# EAGLE design Template_V1.0_vias (EAGLE 7.2.0)
CNAME: EARS PocketQube Template; CREVISION: 1.0; DESIGNER: M. Isbell & L. Stant
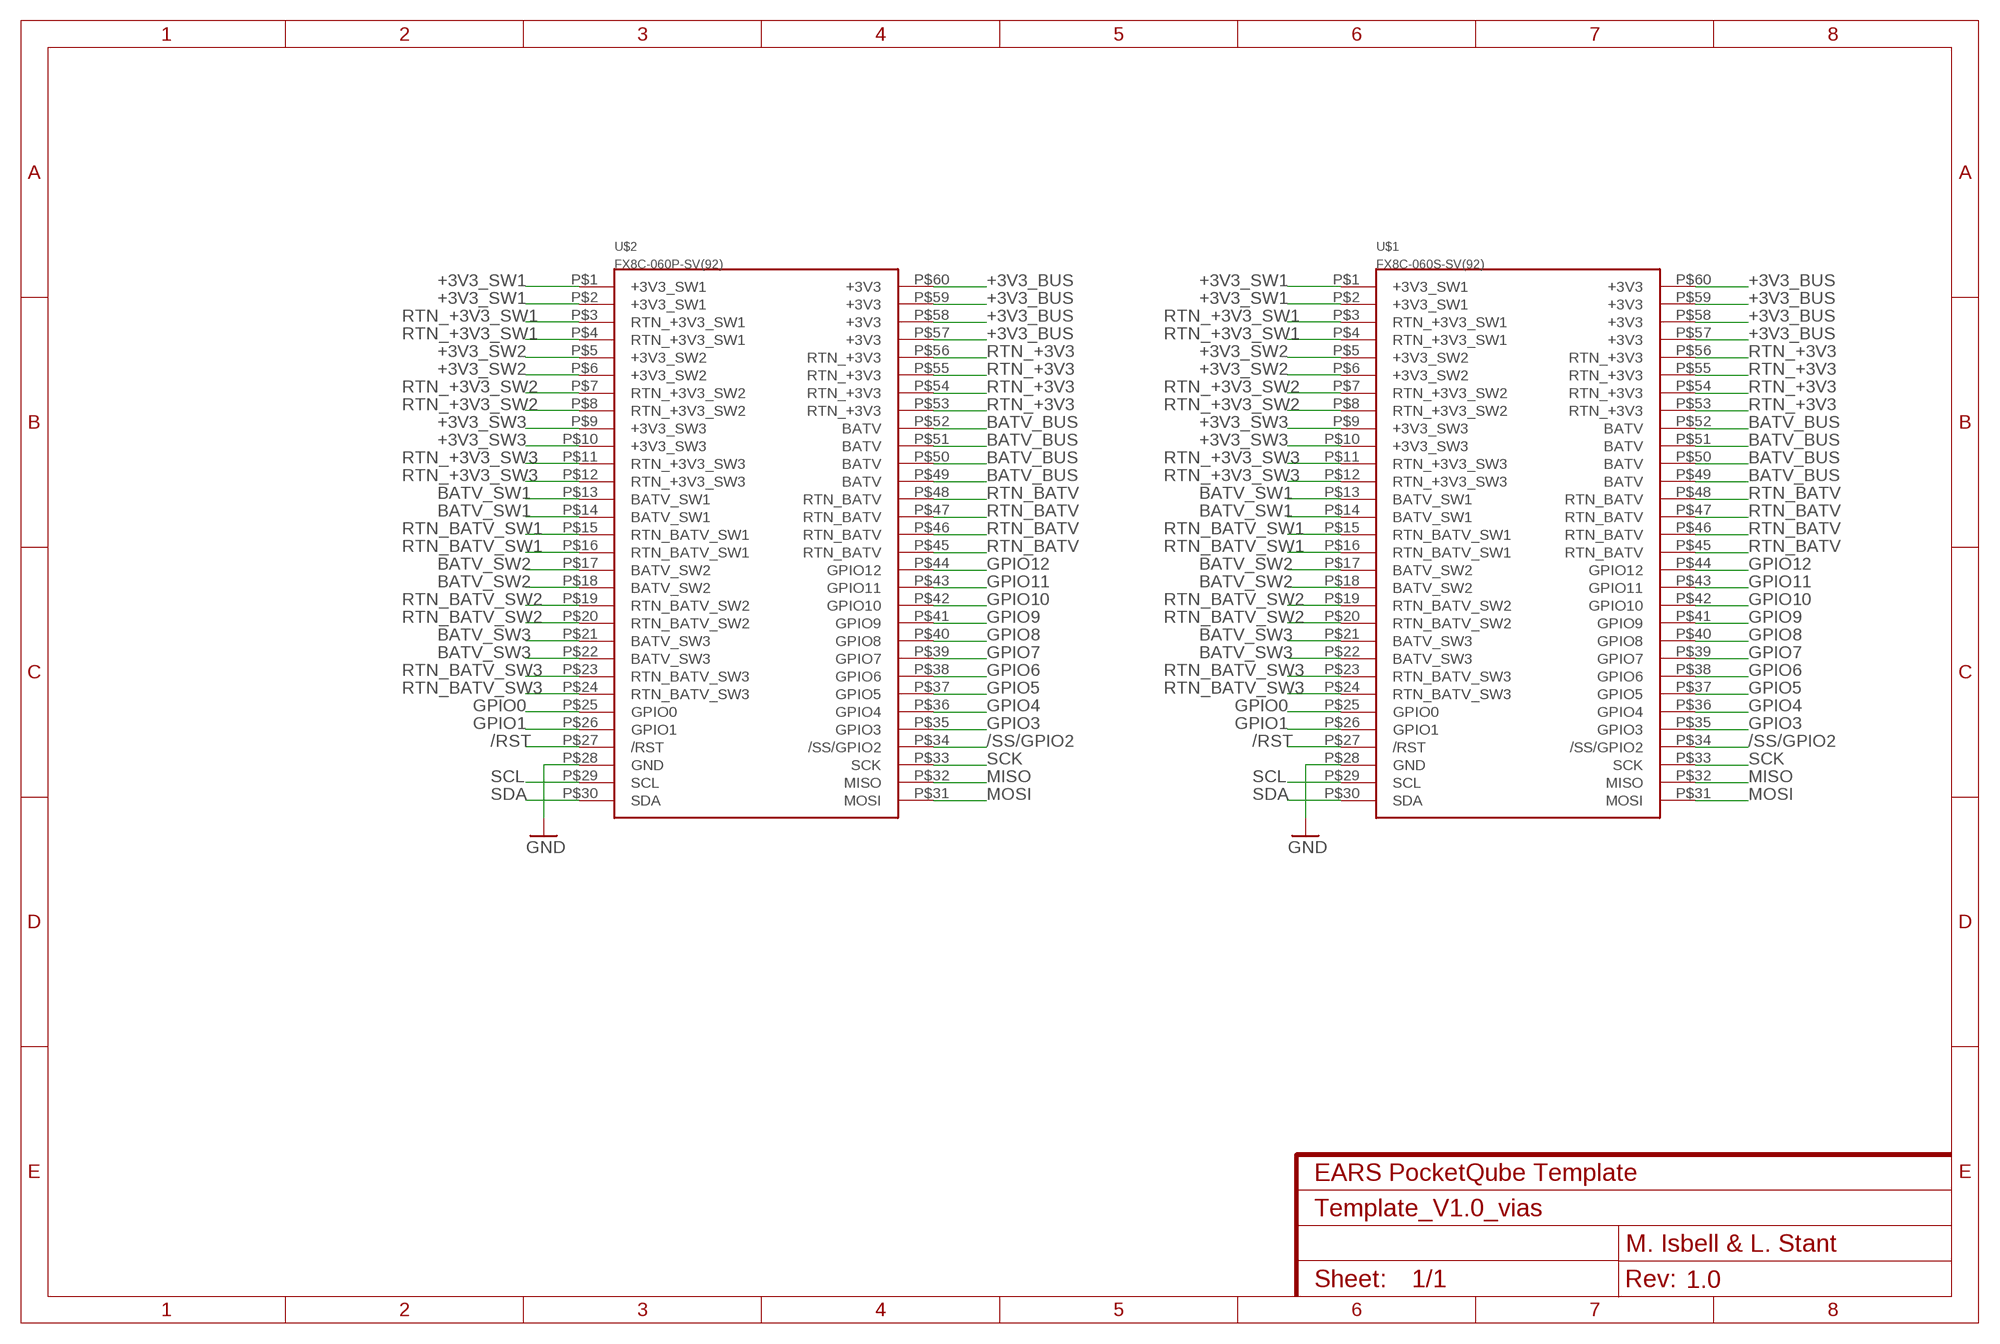
[diagram p0: schematic, sheet 1]

## Parts
U$1  FX8C-060S-SV(92)  [FX8C-060S-SV(92)]
U$2  FX8C-060P-SV(92)  [FX8C-060P-SV(92)]

## Nets
+3V3_BUS: U$1.P$57(+3V3) U$1.P$58(+3V3) U$1.P$59(+3V3) U$1.P$60(+3V3) U$2.P$57(+3V3) U$2.P$58(+3V3) U$2.P$59(+3V3) U$2.P$60(+3V3)
+3V3_SW1: U$1.P$1(+3V3_SW1) U$1.P$2(+3V3_SW1) U$2.P$1(+3V3_SW1) U$2.P$2(+3V3_SW1)
+3V3_SW2: U$1.P$5(+3V3_SW2) U$1.P$6(+3V3_SW2) U$2.P$5(+3V3_SW2) U$2.P$6(+3V3_SW2)
+3V3_SW3: U$1.P$9(+3V3_SW3) U$1.P$10(+3V3_SW3) U$2.P$9(+3V3_SW3) U$2.P$10(+3V3_SW3)
/RST: U$1.P$27(/RST) U$2.P$27(/RST)
/SS/GPIO2: U$1.P$34(/SS/GPIO2) U$2.P$34(/SS/GPIO2)
BATV_BUS: U$1.P$49(BATV) U$1.P$50(BATV) U$1.P$51(BATV) U$1.P$52(BATV) U$2.P$49(BATV) U$2.P$50(BATV) U$2.P$51(BATV) U$2.P$52(BATV)
BATV_SW1: U$1.P$13(BATV_SW1) U$1.P$14(BATV_SW1) U$2.P$13(BATV_SW1) U$2.P$14(BATV_SW1)
BATV_SW2: U$1.P$17(BATV_SW2) U$1.P$18(BATV_SW2) U$2.P$17(BATV_SW2) U$2.P$18(BATV_SW2)
BATV_SW3: U$1.P$21(BATV_SW3) U$1.P$22(BATV_SW3) U$2.P$21(BATV_SW3) U$2.P$22(BATV_SW3)
GND: U$1.P$28(GND) U$2.P$28(GND)
GPIO0: U$1.P$25(GPIO0) U$2.P$25(GPIO0)
GPIO1: U$1.P$26(GPIO1) U$2.P$26(GPIO1)
GPIO3: U$1.P$35(GPIO3) U$2.P$35(GPIO3)
GPIO4: U$1.P$36(GPIO4) U$2.P$36(GPIO4)
GPIO5: U$1.P$37(GPIO5) U$2.P$37(GPIO5)
GPIO6: U$1.P$38(GPIO6) U$2.P$38(GPIO6)
GPIO7: U$1.P$39(GPIO7) U$2.P$39(GPIO7)
GPIO8: U$1.P$40(GPIO8) U$2.P$40(GPIO8)
GPIO9: U$1.P$41(GPIO9) U$2.P$41(GPIO9)
GPIO10: U$1.P$42(GPIO10) U$2.P$42(GPIO10)
GPIO11: U$1.P$43(GPIO11) U$2.P$43(GPIO11)
GPIO12: U$1.P$44(GPIO12) U$2.P$44(GPIO12)
MISO: U$1.P$32(MISO) U$2.P$32(MISO)
MOSI: U$1.P$31(MOSI) U$2.P$31(MOSI)
RTN_+3V3: U$1.P$53(RTN_+3V3) U$1.P$54(RTN_+3V3) U$1.P$55(RTN_+3V3) U$1.P$56(RTN_+3V3) U$2.P$53(RTN_+3V3) U$2.P$54(RTN_+3V3) U$2.P$55(RTN_+3V3) U$2.P$56(RTN_+3V3)
RTN_+3V3_SW1: U$1.P$3(RTN_+3V3_SW1) U$1.P$4(RTN_+3V3_SW1) U$2.P$3(RTN_+3V3_SW1) U$2.P$4(RTN_+3V3_SW1)
RTN_+3V3_SW2: U$1.P$7(RTN_+3V3_SW2) U$1.P$8(RTN_+3V3_SW2) U$2.P$7(RTN_+3V3_SW2) U$2.P$8(RTN_+3V3_SW2)
RTN_+3V3_SW3: U$1.P$11(RTN_+3V3_SW3) U$1.P$12(RTN_+3V3_SW3) U$2.P$11(RTN_+3V3_SW3) U$2.P$12(RTN_+3V3_SW3)
RTN_BATV: U$1.P$45(RTN_BATV) U$1.P$46(RTN_BATV) U$1.P$47(RTN_BATV) U$1.P$48(RTN_BATV) U$2.P$45(RTN_BATV) U$2.P$46(RTN_BATV) U$2.P$47(RTN_BATV) U$2.P$48(RTN_BATV)
RTN_BATV_SW1: U$1.P$15(RTN_BATV_SW1) U$1.P$16(RTN_BATV_SW1) U$2.P$15(RTN_BATV_SW1) U$2.P$16(RTN_BATV_SW1)
RTN_BATV_SW2: U$1.P$19(RTN_BATV_SW2) U$1.P$20(RTN_BATV_SW2) U$2.P$19(RTN_BATV_SW2) U$2.P$20(RTN_BATV_SW2)
RTN_BATV_SW3: U$1.P$23(RTN_BATV_SW3) U$1.P$24(RTN_BATV_SW3) U$2.P$23(RTN_BATV_SW3) U$2.P$24(RTN_BATV_SW3)
SCK: U$1.P$33(SCK) U$2.P$33(SCK)
SCL: U$1.P$29(SCL) U$2.P$29(SCL)
SDA: U$1.P$30(SDA) U$2.P$30(SDA)

## Library data of the parts
U$1 = Template:FX8C-060S-SV(92)
U$2 = Template:FX8C-060P-SV(92)

## Board
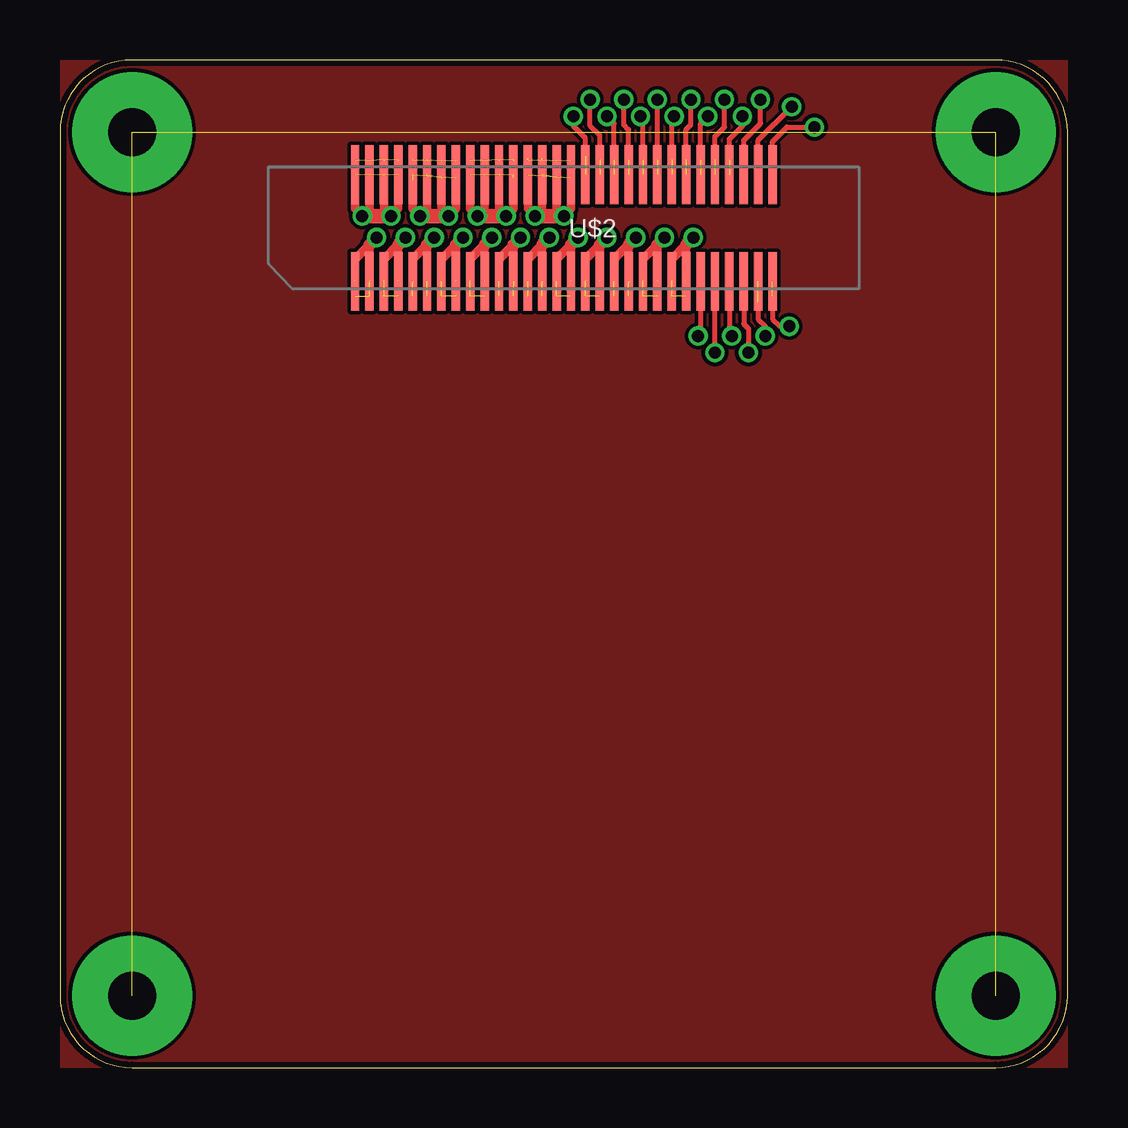
[diagram p1: board, top side]
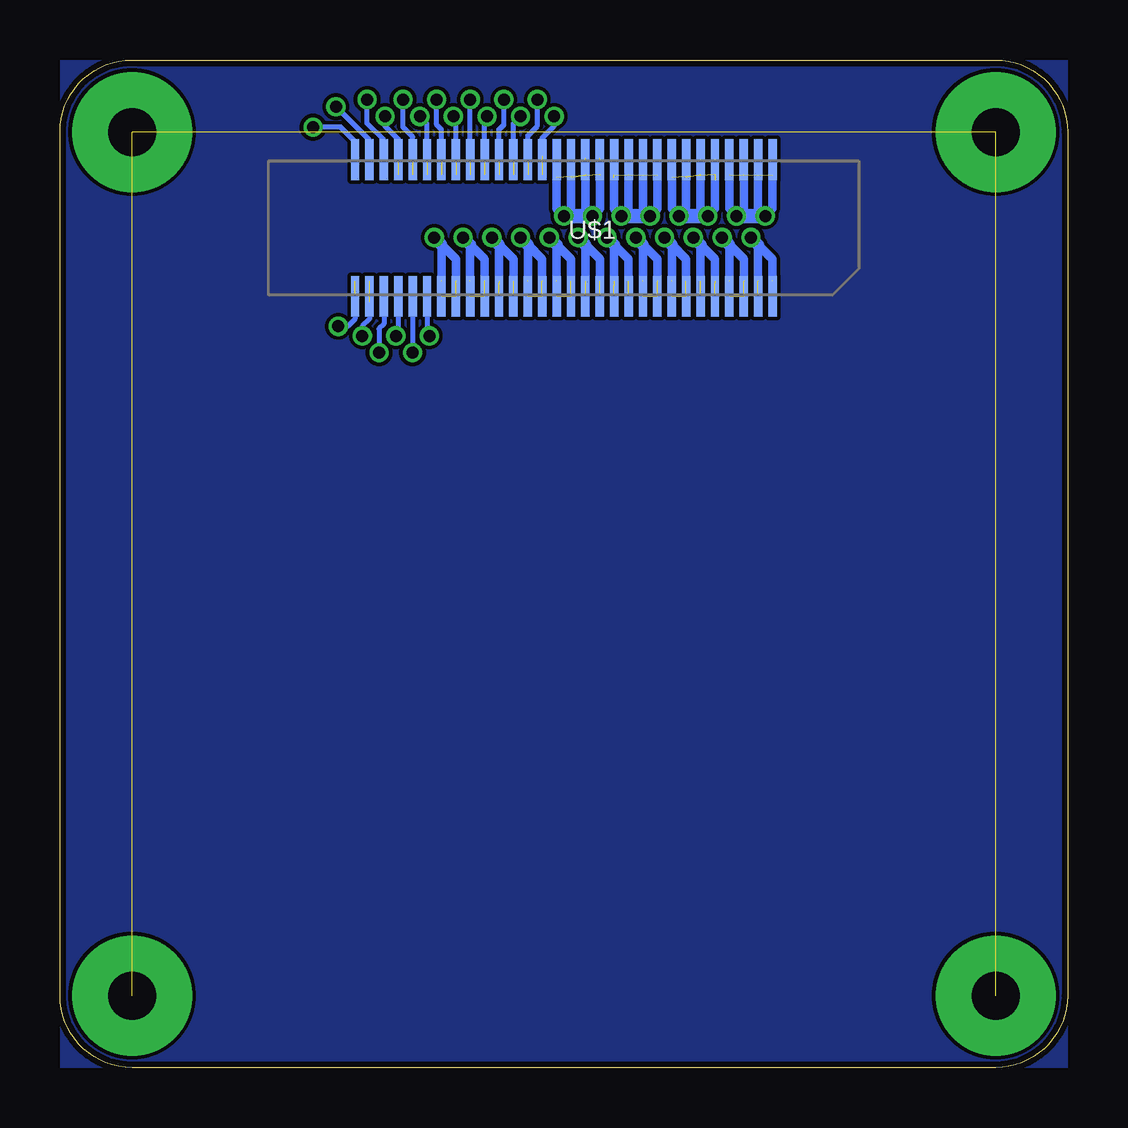
[diagram p2: board, bottom side, seen from below]

Size 42 x 42 mm. Coordinates in mm from the lower left corner, seen from the top.
Outline: 3,0 39,0 arc90 42,3 42,39 arc90 39,42 3,42 arc90 0,39 0,3 arc90 3,0
Copper layers (1*16): Top 0.035mm / dielectric 1.5mm / Bottom 0.035mm
Design rules "SeeedStudio_2layer_DRU_no_angle_20140221 *": minimum track width 6mil, minimum drill 0.5mm, track to track 6mil, track to pad 6mil, pad to pad 6mil, via to via 6mil, smd to smd 0mil, copper to edge 10mil, drill to drill 10mil, minimum pad ring 10mil, minimum via ring 6mil, stop-mask expansion 2mil, vias tented up to drill 100mil, thermal gap 10mil

### Footprints (pad centres in the part's own frame; a part is rotated, then mirrored left to right if it is on the bottom)
FX8C-060S-SV(92) = smd 0.35 x 1.7: P$1 -8.7,2.85; P$2 -8.1,2.85; P$3 -7.5,2.85; P$4 -6.9,2.85; P$5 -6.3,2.85; P$6 -5.7,2.85; P$7 -5.1,2.85; P$8 -4.5,2.85; P$9 -3.9,2.85; P$10 -3.3,2.85; P$11 -2.7,2.85; P$12 -2.1,2.85; P$13 -1.5,2.85; P$14 -0.9,2.85; P$15 -0.3,2.85; P$16 0.3,2.85; P$17 0.9,2.85; P$18 1.5,2.85; P$19 2.1,2.85; P$20 2.7,2.85; P$21 3.3,2.85; P$22 3.9,2.85; P$23 4.5,2.85; P$24 5.1,2.85; P$25 5.7,2.85; P$26 6.3,2.85; P$27 6.9,2.85; P$28 7.5,2.85; P$29 8.1,2.85; P$30 8.7,2.85; P$31 8.7,-2.85; P$32 8.1,-2.85; P$33 7.5,-2.85; P$34 6.9,-2.85; P$35 6.3,-2.85; P$36 5.7,-2.85; P$37 5.1,-2.85; P$38 4.5,-2.85; P$39 3.9,-2.85; P$40 3.3,-2.85; P$41 2.7,-2.85; P$42 2.1,-2.85; P$43 1.5,-2.85; P$44 0.9,-2.85; P$45 0.3,-2.85; P$46 -0.3,-2.85; P$47 -0.9,-2.85; P$48 -1.5,-2.85; P$49 -2.1,-2.85; P$50 -2.7,-2.85; P$51 -3.3,-2.85; P$52 -3.9,-2.85; P$53 -4.5,-2.85; P$54 -5.1,-2.85; P$55 -5.7,-2.85; P$56 -6.3,-2.85; P$57 -6.9,-2.85; P$58 -7.5,-2.85; P$59 -8.1,-2.85; P$60 -8.7,-2.85
FX8C-060P-SV(92) = smd 0.35 x 2.45: P$1 -8.7,-2.225; P$2 -8.1,-2.225; P$3 -7.5,-2.225; P$4 -6.9,-2.225; P$5 -6.3,-2.225; P$6 -5.7,-2.225; P$7 -5.1,-2.225; P$8 -4.5,-2.225; P$9 -3.9,-2.225; P$10 -3.3,-2.225; P$11 -2.7,-2.225; P$12 -2.1,-2.225; P$13 -1.5,-2.225; P$14 -0.9,-2.225; P$15 -0.3,-2.225; P$16 0.3,-2.225; P$17 0.9,-2.225; P$18 1.5,-2.225; P$19 2.1,-2.225; P$20 2.7,-2.225; P$21 3.3,-2.225; P$22 3.9,-2.225; P$23 4.5,-2.225; P$24 5.1,-2.225; P$25 5.7,-2.225; P$26 6.3,-2.225; P$27 6.9,-2.225; P$28 7.5,-2.225; P$29 8.1,-2.225; P$30 8.7,-2.225; P$31 8.7,2.225; P$32 8.1,2.225; P$33 7.5,2.225; P$34 6.9,2.225; P$35 6.3,2.225; P$36 5.7,2.225; P$37 5.1,2.225; P$38 4.5,2.225; P$39 3.9,2.225; P$40 3.3,2.225; P$41 2.7,2.225; P$42 2.1,2.225; P$43 1.5,2.225; P$44 0.9,2.225; P$45 0.3,2.225; P$46 -0.3,2.225; P$47 -0.9,2.225; P$48 -1.5,2.225; P$49 -2.1,2.225; P$50 -2.7,2.225; P$51 -3.3,2.225; P$52 -3.9,2.225; P$53 -4.5,2.225; P$54 -5.1,2.225; P$55 -5.7,2.225; P$56 -6.3,2.225; P$57 -6.9,2.225; P$58 -7.5,2.225; P$59 -8.1,2.225; P$60 -8.7,2.225

### Placement (x,y rotation side)
U$1  21,35 180 bottom
U$2  21,35 0 top

### Tracks (layer width: path | path; a pad name or v marks a point on that pad's centre or on a via)
+3V3_BUS  (via drill 0.5)  (7 unrouted)
  Top 0.35: U$2.P$57 14.1,35.8 v13.8,35.5 13.5,35.8 13.5,37.2 | 12.9,37.2 12.9,35.8 v12.6,35.5 12.3,35.8 12.3,37.2
  Top 0.6: v12.6,35.5 v13.8,35.5
  Bottom 0.35: 12.3,37.8 12.3,35.8 v12.6,35.5 12.9,35.8 12.9,37.8 | 13.5,37.8 13.5,35.8 v13.8,35.5 14.1,35.8 14.1,37.8
  Bottom 0.6: v12.6,35.5 v13.8,35.5
+3V3_SW1  (via drill 0.5)  (4 unrouted)
  Top 0.35: 12.9,33.8 12.9,34.3 12.3,33.7 12.3,32.8
  Top 0.5: 12.9,34.3 v13.2,34.6
  Bottom 0.35: 12.9,32.8 12.9,34.3 12.3,33.7 12.3,32.8
  Bottom 0.5: 12.9,34.3 v13.2,34.6
+3V3_SW2  (via drill 0.5)  (4 unrouted)
  Top 0.35: 15.3,33.8 15.3,34.3 14.7,33.7
  Top 0.5: 15.3,34.3 v15.6,34.6
  Bottom 0.35: 15.3,32.7 15.3,34.3 14.7,33.7 14.7,32.7
  Bottom 0.5: v15.6,34.6 15.3,34.3
+3V3_SW3  (via drill 0.5)  (4 unrouted)
  Top 0.35: 17.7,33.8 17.7,34.3 17.1,33.7
  Top 0.5: 17.7,34.3 v18,34.6
  Bottom 0.35: 17.7,32.8 17.7,34.3 17.1,33.7 17.1,32.8
  Bottom 0.5: v18,34.6 17.7,34.3
/RST  (via drill 0.5)
  Top 0.2: U$2.P$27 27.9,30.6 v28,30.5
  Bottom 0.2: U$1.P$27 27.9,30.6 v28,30.5
/SS/GPIO2  (via drill 0.5)  (1 unrouted)
  Top 0.2: 27.9,38.2 27.9,38.7 28.45,39.25 v28.45,39.65
  Bottom 0.2: U$1.P$34 27.9,38.7 28.45,39.25 v28.45,39.65
BATV_BUS  (via drill 0.5)  (8 unrouted)
  Top 0.35: 17.1,37.2 17.1,35.8 v17.4,35.5 17.7,35.8 17.7,37.2 | 18.3,37.2 18.3,35.8 v18.6,35.5 18.9,35.8 18.9,37.1
  Top 0.6: v17.4,35.5 v18.6,35.5
  Bottom 0.35: 17.1,37.8 17.1,35.8 v17.4,35.5 17.7,35.8 17.7,37.8 | 18.3,37.8 18.3,35.8 v18.6,35.5 18.9,35.8 18.9,37.8
  Bottom 0.6: v17.4,35.5 v18.6,35.5
BATV_SW1  (via drill 0.5)  (4 unrouted)
  Top 0.35: 20.1,33.8 20.1,34.3 19.5,33.7
  Top 0.5: v20.4,34.6 20.1,34.3
  Bottom 0.35: 20.1,32.7 20.1,34.3 19.5,33.7 19.5,32.6
  Bottom 0.5: v20.4,34.6 20.1,34.3
BATV_SW2  (via drill 0.5)  (4 unrouted)
  Top 0.35: 22.5,33.8 22.5,34.3 21.9,33.7
  Top 0.5: v22.8,34.6 22.5,34.3
  Bottom 0.35: 22.5,32.8 22.5,34.3 21.9,33.7 21.9,32.8
  Bottom 0.5: v22.8,34.6 22.5,34.3
BATV_SW3  (via drill 0.5)  (4 unrouted)
  Top 0.35: 24.9,33.9 24.9,34.3 24.3,33.7
  Top 0.5: v25.2,34.6 24.9,34.3
  Bottom 0.35: 24.9,32.8 24.9,34.3 24.3,33.7 24.3,32.8
  Bottom 0.5: v25.2,34.6 24.9,34.3
BOARD
  pour Bottom: 0,42 42,42 42,0 0,0
  pour Top: 0,42 42,42 42,0 0,0
CHASSIS_GND  (via drill 2 pad 5)  (3 unrouted)
  other vias: 3,39 39,39 39,3 3,3
GND  (via drill 0.5)
  Top 0.2: U$2.P$28 28.5,31 28.7,30.8 v28.7,29.8
  Bottom 0.2: U$1.P$28 28.5,31 28.7,30.8 v28.7,29.8
GPIO0  (via drill 0.5)
  Top 0.2: U$2.P$25 26.7,30.6 v26.6,30.5
  Bottom 0.2: U$1.P$25 26.7,30.6 v26.6,30.5
GPIO1  (via drill 0.5)
  Top 0.2: v27.3,29.8 U$2.P$26
  Bottom 0.2: U$1.P$26 v27.3,29.8
GPIO3  (via drill 0.5)  (1 unrouted)
  Top 0.2: 27.3,38.1 27.3,38.8 27.7,39.2 v27.7,40.35
  Bottom 0.2: U$1.P$35 27.3,38.8 27.7,39.2 v27.7,40.35
GPIO4  (via drill 0.5)  (1 unrouted)
  Top 0.2: 26.7,38.1 26.7,39.35 v27,39.65
  Bottom 0.2: U$1.P$36 26.7,39.35 v27,39.65
GPIO5  (via drill 0.5)  (1 unrouted)
  Top 0.2: 26.1,38.2 26.1,39.1 26.3,39.3 v26.3,40.35
  Bottom 0.2: U$1.P$37 26.1,39.1 26.3,39.3 v26.3,40.35
GPIO6  (via drill 0.5)  (1 unrouted)
  Top 0.2: 25.5,38.2 25.5,39.55 v25.6,39.65
  Bottom 0.2: U$1.P$38 25.5,39.55 v25.6,39.65
GPIO7  (via drill 0.5)  (1 unrouted)
  Top 0.2: 24.9,38.2 v24.9,40.35
  Bottom 0.2: U$1.P$39 v24.9,40.35
GPIO8  (via drill 0.5)  (1 unrouted)
  Top 0.2: 24.3,38.1 24.3,39.55 v24.2,39.65
  Bottom 0.2: U$1.P$40 24.3,39.55 v24.2,39.65
GPIO9  (via drill 0.5)  (1 unrouted)
  Top 0.2: 23.7,38.3 23.7,39.1 23.5,39.3 v23.5,40.35
  Bottom 0.2: U$1.P$41 23.7,39.1 23.5,39.3 v23.5,40.35
GPIO10  (via drill 0.5)  (1 unrouted)
  Top 0.2: 23.1,38.1 23.1,39.35 v22.8,39.65
  Bottom 0.2: U$1.P$42 23.1,39.35 v22.8,39.65
GPIO11  (via drill 0.5)  (1 unrouted)
  Top 0.2: 22.5,38.3 22.5,38.85 22.1,39.25 v22.1,40.35
  Bottom 0.2: U$1.P$43 22.5,38.85 22.1,39.25 v22.1,40.35
GPIO12  (via drill 0.5)  (2 unrouted)
  Top 0.2: 21.9,38 21.9,38.75 21.4,39.25 v21.4,39.65
  Bottom 0.2: 21.9,38.45 21.9,38.75 21.4,39.25 v21.4,39.65
MISO  (via drill 0.5)
  Top 0.2: U$2.P$32 29.1,38.65 v30.5,40.05
  Bottom 0.2: U$1.P$32 29.1,38.65 v30.5,40.05
MOSI  (via drill 0.5)
  Top 0.2: U$2.P$31 29.7,38.6 30.3,39.2 v31.45,39.2
  Bottom 0.2: U$1.P$31 29.7,38.6 30.3,39.2 v31.45,39.2
RTN_+3V3  (via drill 0.5)  (8 unrouted)
  Top 0.35: 14.7,37 14.7,35.8 v15,35.5 15.3,35.8 15.3,37.2 | 15.9,37.1 15.9,35.8 v16.2,35.5 16.5,35.8 16.5,37.1
  Top 0.6: v15,35.5 v16.2,35.5
  Bottom 0.35: 14.7,37.8 14.7,35.8 v15,35.5 15.3,35.8 15.3,37.8 | 15.9,37.8 15.9,35.8 v16.2,35.5 16.5,35.8 16.5,37.8
  Bottom 0.6: v15,35.5 v16.2,35.5
RTN_+3V3_SW1  (via drill 0.5)  (4 unrouted)
  Top 0.35: 14.1,33.9 14.1,34.3 13.5,33.7
  Top 0.5: v14.4,34.6 14.1,34.3
  Bottom 0.35: 14.1,32.8 14.1,34.3 13.5,33.7 13.5,32.8
  Bottom 0.5: v14.4,34.6 14.1,34.3
RTN_+3V3_SW2  (via drill 0.5)  (4 unrouted)
  Top 0.35: 16.5,33.8 16.5,34.3 15.9,33.7
  Top 0.5: 16.5,34.3 v16.8,34.6
  Bottom 0.35: 16.5,32.8 16.5,34.3 15.9,33.7 15.9,32.7
  Bottom 0.5: v16.8,34.6 16.5,34.3
RTN_+3V3_SW3  (via drill 0.5)  (4 unrouted)
  Top 0.35: 18.9,33.8 18.9,34.3 18.3,33.7
  Top 0.5: v19.2,34.6 18.9,34.3
  Bottom 0.35: 18.9,32.6 18.9,34.3 18.3,33.7 18.3,32.7
  Bottom 0.5: v19.2,34.6 18.9,34.3
RTN_BATV  (via drill 0.5)  (8 unrouted)
  Top 0.35: 19.5,37.2 19.5,35.8 v19.8,35.5 20.1,35.8 20.1,37.2 | 20.7,37.1 20.7,35.8 v21,35.5 21.3,35.8 21.3,37.1
  Top 0.6: v19.8,35.5 v21,35.5
  Bottom 0.35: 19.5,37.9 19.5,35.8 v19.8,35.5 20.1,35.8 20.1,37.9 | 20.7,37.8 20.7,35.8 v21,35.5 21.3,35.8 21.3,37.8
  Bottom 0.6: v19.8,35.5 v21,35.5
RTN_BATV_SW1  (via drill 0.5)  (4 unrouted)
  Top 0.35: 21.3,33.9 21.3,34.3 20.7,33.7
  Top 0.5: v21.6,34.6 21.3,34.3
  Bottom 0.35: 21.3,32.8 21.3,34.3 20.7,33.7 20.7,32.7
  Bottom 0.5: v21.6,34.6 21.3,34.3
RTN_BATV_SW2  (via drill 0.5)  (4 unrouted)
  Top 0.35: 23.7,33.8 23.7,34.3 23.1,33.7
  Top 0.5: v24,34.6 23.7,34.3
  Bottom 0.35: 23.7,32.7 23.7,34.3 23.1,33.7 23.1,32.7
  Bottom 0.5: v24,34.6 23.7,34.3
RTN_BATV_SW3  (via drill 0.5)  (4 unrouted)
  Top 0.35: 26.1,33.8 26.1,34.3 25.5,33.7
  Top 0.5: v26.4,34.6 26.1,34.3
  Bottom 0.35: 26.1,32.8 26.1,34.3 25.5,33.7 25.5,32.8
  Bottom 0.5: v26.4,34.6 26.1,34.3
SCK  (via drill 0.5)
  Top 0.2: U$2.P$33 28.5,38.65 29.2,39.35 v29.2,40.35
  Bottom 0.2: U$1.P$33 28.5,38.65 29.2,39.35 v29.2,40.35
SCL  (via drill 0.5)  (2 unrouted)
  Top 0.2: 29.1,31.7 29.1,31.2 29.4,30.9 v29.4,30.5
  Bottom 0.2: 29.1,31.9 29.1,31.2 29.4,30.9 v29.4,30.5
SDA  (via drill 0.5)  (2 unrouted)
  Top 0.2: v30.4,30.9 30,30.9 29.7,31.2 29.7,31.7
  Bottom 0.2: 29.7,32.2 29.7,31.2 30,30.9 v30.4,30.9

### Text on the board
tDocu: SurreyEARS Pocketqube | Template Board with Vias | V1.0